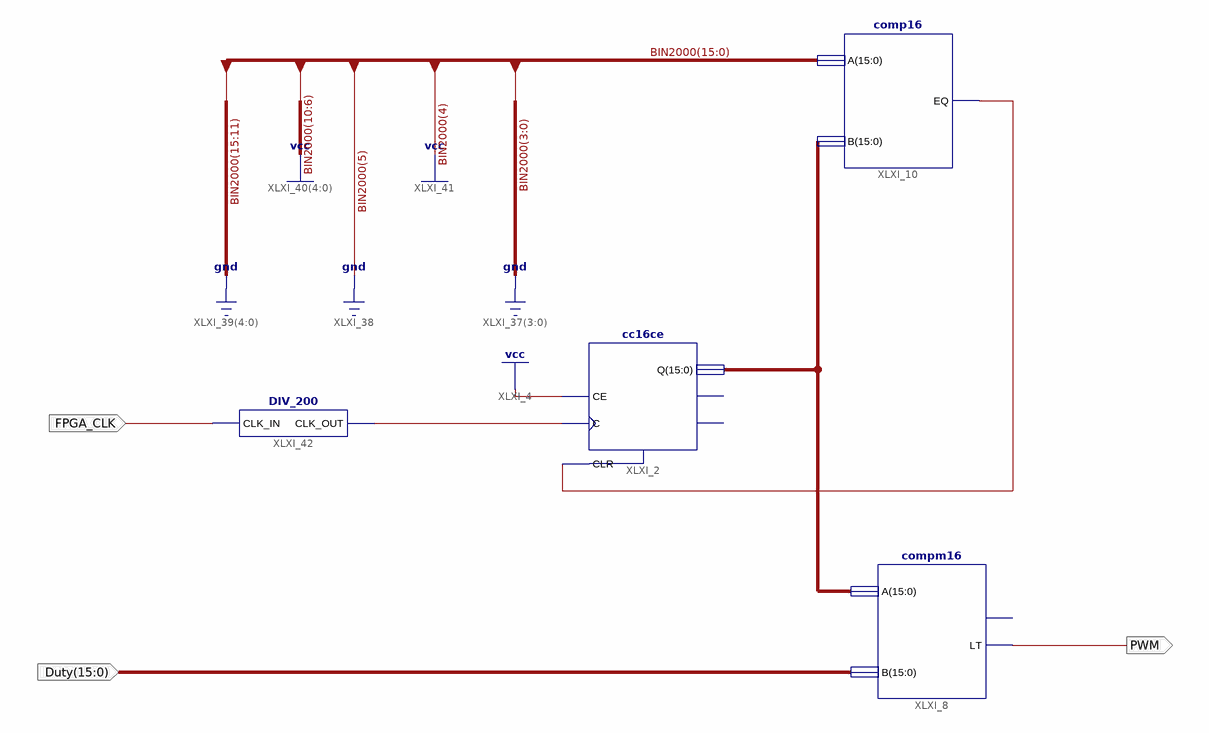
[diagram p0: schematic sheet 1]
// Xilinx ISE schematic PWM_Gen.sch (spartan6) as structural Verilog: 4 symbols, 3 ports
module PWM_Gen (
  input  [15:0] Duty,
  input  FPGA_CLK,
  output PWM
);

  wire XLXN_1, XLXN_7;
  wire [15:0] XLXN_5;

  cc16ce XLXI_2 (.C(XLXN_1), .CE(1'b1), .CLR(XLXN_7), .Q(XLXN_5));  // open: CEO, TC
  compm16 XLXI_8 (.A(XLXN_5), .B(Duty), .LT(PWM));  // open: GT
  comp16 XLXI_10 (.A(16'b0000011111010000), .B(XLXN_5), .EQ(XLXN_7));
  DIV_200 XLXI_42 (.CLK_IN(FPGA_CLK), .CLK_OUT(XLXN_1));
endmodule
